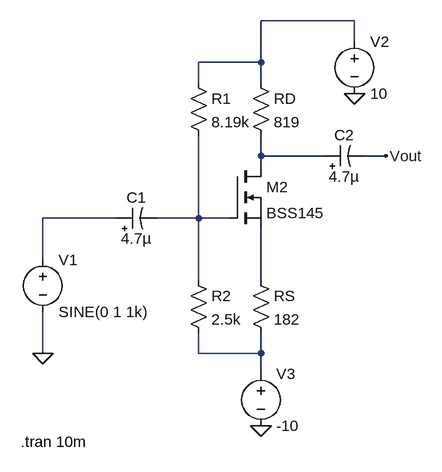
[diagram p0: schematic Draft5.3b.asc]
Draft5.3b.asc, the LTspice schematic file:
Version 4
SHEET 1 1256 680
WIRE 1136 -96 992 -96
WIRE 1136 -64 1136 -96
WIRE 992 -32 992 -96
WIRE 992 -32 896 -32
WIRE 896 0 896 -32
WIRE 992 0 992 -32
WIRE 992 112 992 80
WIRE 1088 112 992 112
WIRE 1184 112 1152 112
WIRE 992 128 992 112
WIRE 768 208 656 208
WIRE 896 208 896 80
WIRE 896 208 832 208
WIRE 944 208 896 208
WIRE 656 272 656 208
WIRE 896 304 896 208
WIRE 992 304 992 224
WIRE 656 416 656 352
WIRE 896 416 896 384
WIRE 992 416 992 384
WIRE 992 416 896 416
WIRE 992 448 992 416
FLAG 656 416 0
FLAG 1136 16 0
FLAG 992 528 0
FLAG 1184 112 Vout
SYMBOL voltage 656 256 R0
WINDOW 123 0 0 Left 0
WINDOW 39 0 0 Left 0
SYMATTR InstName V1
SYMATTR Value SINE(0 1 1k)
SYMBOL polcap 768 224 R270
WINDOW 0 32 32 VTop 2
WINDOW 3 0 32 VBottom 2
SYMATTR InstName C1
SYMATTR Value 4.7µ
SYMATTR Description Capacitor
SYMATTR Type cap
SYMATTR SpiceLine V=25 Irms=24m Rser=5 Lser=0 mfg="Nichicon" pn="UPR1E4R7MAH" type="Al electrolytic"
SYMBOL res 880 -16 R0
SYMATTR InstName R1
SYMATTR Value 8.19k
SYMBOL res 880 288 R0
SYMATTR InstName R2
SYMATTR Value 2.5k
SYMBOL nmos 944 128 R0
SYMATTR InstName M2
SYMATTR Value BSS145
SYMBOL res 976 -16 R0
SYMATTR InstName RD
SYMATTR Value 819
SYMBOL res 976 288 R0
SYMATTR InstName RS
SYMATTR Value 182
SYMBOL polcap 1088 128 R270
WINDOW 0 32 32 VTop 2
WINDOW 3 0 32 VBottom 2
SYMATTR InstName C2
SYMATTR Value 4.7µ
SYMATTR Description Capacitor
SYMATTR Type cap
SYMATTR SpiceLine V=25 Irms=24m Rser=5 Lser=0 mfg="Nichicon" pn="UPR1E4R7MAH" type="Al electrolytic"
SYMBOL voltage 1136 -80 R0
WINDOW 123 0 0 Left 0
WINDOW 39 0 0 Left 0
SYMATTR InstName V2
SYMATTR Value 10
SYMBOL voltage 992 432 R0
WINDOW 123 0 0 Left 0
WINDOW 39 0 0 Left 0
SYMATTR InstName V3
SYMATTR Value -10
TEXT 622 552 Left 2 !.tran 10m

The netlist it stands for:
* Draft5.3b.asc
V1 N003 0 SINE(0 1 1k)
C1 N003 N004 4.7µ V=25 Irms=24m Rser=5 Lser=0 mfg="Nichicon" pn="UPR1E4R7MAH" type="Al electrolytic"
R1 N001 N004 8.19k
R2 N004 N006 2.5k
M2 N002 N004 N005 N005 BSS145
RD N001 N002 819
RS N005 N006 182
C2 N002 Vout 4.7µ V=25 Irms=24m Rser=5 Lser=0 mfg="Nichicon" pn="UPR1E4R7MAH" type="Al electrolytic"
V2 N001 0 10
V3 N006 0 -10
.model NMOS NMOS
.model PMOS PMOS
.lib standard.mos
.tran 10m
.backanno
.end